# Altium schematic sheet power.SchDoc
size A
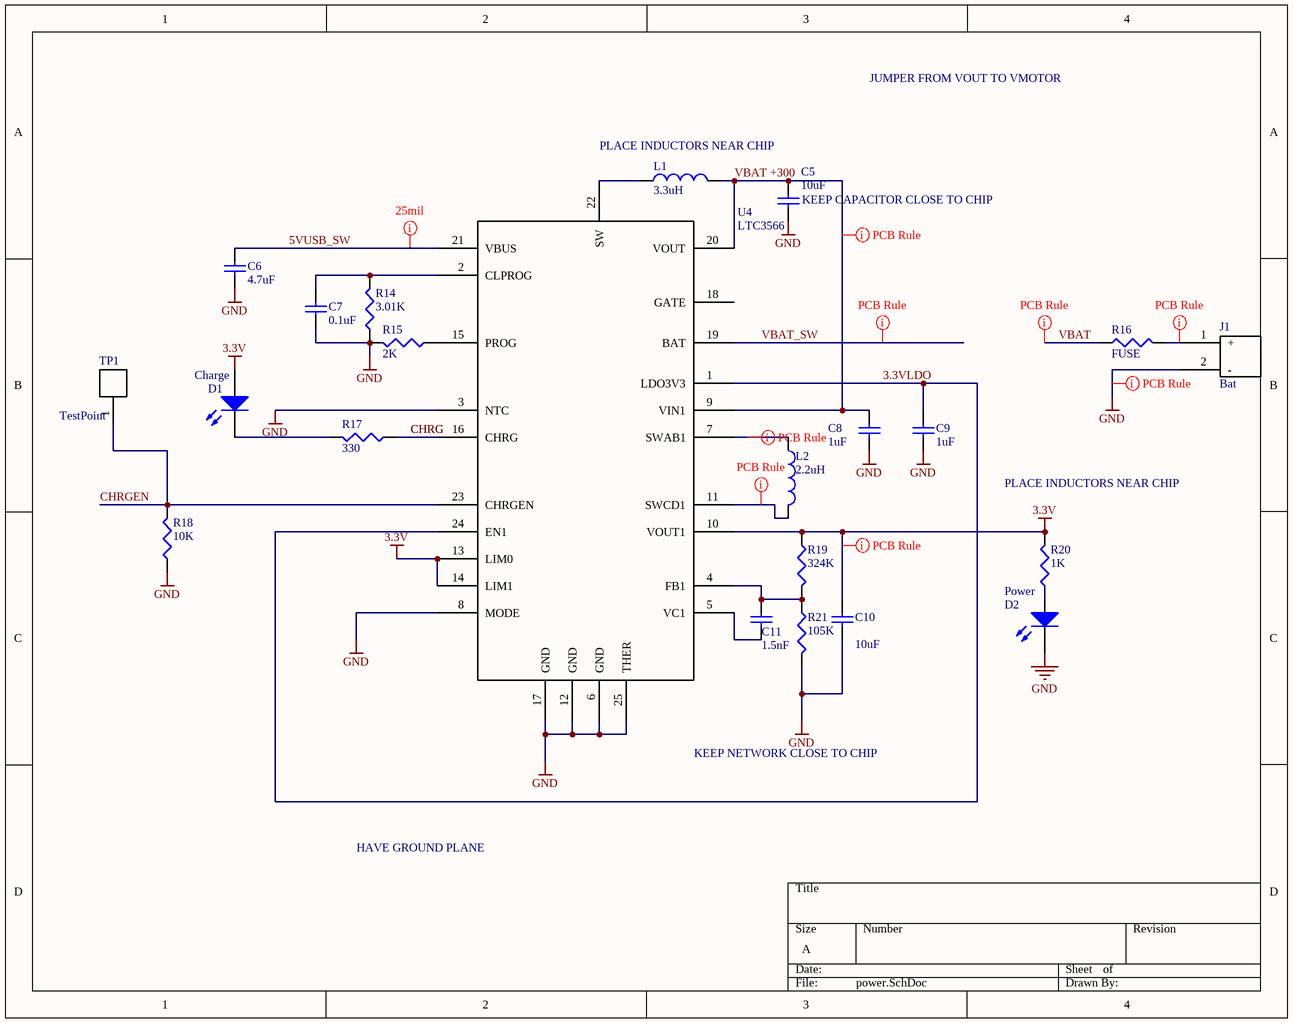
[diagram p0: power.SchDoc]

## Parts
C5  value 10uF  [CAPC1608L]  (hidden comment: Cap)
C6  value 4.7uF  [CAPC1608L]  (hidden comment: Cap)
C7  value 0.1uF  [CAPC1005L]  (hidden comment: Cap)
C8  value 1uF  [CAPC1608L]  (hidden comment: Cap)
C9  value 1uF  [CAPC1608L]  (hidden comment: Cap)
C10  value 10uF  [CAPC1608L]  (hidden comment: Cap)
C11  value 1.5nF  [CAPC1005L]  (hidden comment: Cap)
D1  Charge  [INDC2012L]
D2  Power  [INDC2012L]
J1  Bat  [BatteryConnJST]
L1  3.3uH  [Inductor-Power]
L2  2.2uH  [Inductor-Power]
R14  value 3.01K  [RESC1608L]  (hidden comment: Res3)
R15  value 2K  [RESC1608L]  (hidden comment: Res3)
R16  value FUSE  [RESC3225L]  (hidden comment: Res3)
R17  value 330  [RESC1608L]  (hidden comment: Res3)
R18  value 10K  [RESC1608L]  (hidden comment: Res3)
R19  value 324K  [RESC1608L]  (hidden comment: Res3)
R20  value 1K  [RESC1608L]  (hidden comment: Res3)
R21  value 105K  [RESC1608L]  (hidden comment: Res3)
TP1  TestPoint  [TestPoint]
U4  LTC3566  [QFN-24]

## Nets
3.3V: C10.2 D1.1(A) R19.1 R20.2 U4.10(VOUT1) U4.13(LIM0) U4.14(LIM1)
GND: C5.1 C6.1 C7.1 C8.2 C9.2 C10.1 D2.2(K) J1.2(-) R14.1 R15.2 R18.1 R21.2 U4.3(NTC) U4.6(GND) U4.8(MODE) U4.12(GND) U4.17(GND) U4.25(THER)
3.3VLDO: C9.1 U4.1(LDO3V3) U4.24(EN1)
5VUSB_SW: C6.2 U4.21(VBUS)
CHRG: R17.1 U4.16(CHRG)
CHRGEN: R18.2 TP1.1 U4.23(CHRGEN)
VBAT: R16.1
VBAT +300: C5.2 C8.1 L1.2 U4.9(VIN1) U4.20(VOUT)
VBAT_SW: U4.19(BAT)
NetC7_2: C7.2 R14.2 U4.2(CLPROG)
NetC11_1: C11.1 R19.2 R21.1 U4.4(FB1)
NetC11_2: C11.2 U4.5(VC1)
NetD1_2: D1.2(K) R17.2
NetD2_1: D2.1(A) R20.1
NetJ1_1: J1.1(+) R16.2
NetL1_1: L1.1 U4.22(SW)
NetL2_1: L2.1 U4.7(SWAB1)
NetL2_2: L2.2 U4.11(SWCD1)
NetR15_1: R15.1 U4.15(PROG)

Not connected (* = marked no-connect by the designer): U4 18(GATE)

## Layout directives
rule Width Constraint [Pref Width = 25mil    Min Width = 10mil    Max Width = 25mil]: 5VUSB_SW, GND, NetJ1_1, NetL2_1, NetL2_2, VBAT, VBAT +300
rule Width Constraint [Pref Width = 25mil    Min Width = 10mil    Max Width = 100mil]: 3.3V
rule Width Constraint [Pref Width = 25mil    Min Width = 10mil    Max Width = 50mil]: VBAT_SW

## Notes on the sheet
- JUMPER FROM VOUT TO VMOTOR
- (near L1) PLACE INDUCTORS NEAR CHIP
- (near C5) KEEP CAPACITOR CLOSE TO CHIP
- CHRG
- PLACE INDUCTORS NEAR CHIP
- KEEP NETWORK CLOSE TO CHIP
- HAVE GROUND PLANE

## Library data of the parts
C5-C11 = Cap: Capacitor; Published: 8-Jun-2000; LatestRevisionDate: 17-Jul-2002; LatestRevisionNote: Re-released for DXP Platform.; PackageReference: RAD-0.3; Publisher: Altium Limited
D1 D2 = LED2: Typical RED, GREEN, YELLOW, AMBER GaAs LED; Published: 8-Jun-2000; LatestRevisionDate: 17-Jul-2002; LatestRevisionNote: Re-released for DXP Platform.; PackageVersion: Feb-2002; PackageReference: 3.2X1.6X1.1; Publisher: Altium Limited
J1 = BatteryConnJST
L1 L2 = Inductor
R14-R21 = Res3: Resistor; Published: 8-Jun-2000; LatestRevisionDate: 29-May-2009; LatestRevisionNote: IPC-7351 Footprint Added.; PackageReference: J1-0603; Publisher: Altium Limited; PackageDescription: Chip Resistor